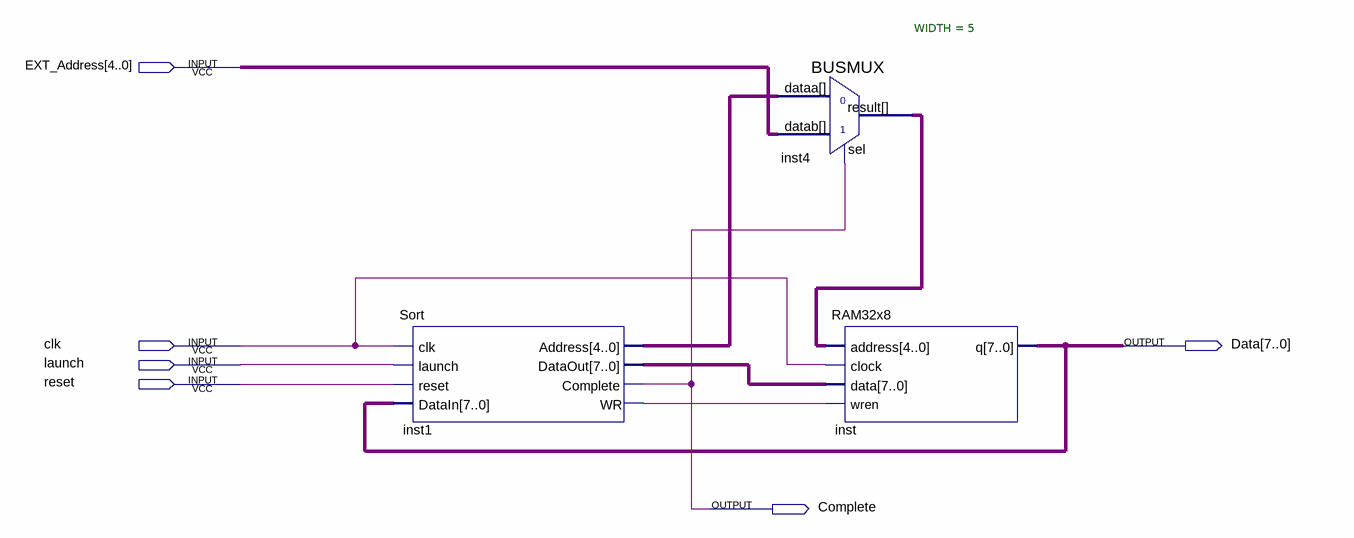
[diagram p0: schematic sheet]
// Quartus schematic Sorter_v2.bdf as structural Verilog: 3 symbols, 6 pins
module Sorter_v2 (
  input  [4:0] EXT_Address,
  input  clk,
  input  launch,
  input  reset,
  output [7:0] Data,
  output Complete
);

  wire inst1_wr;
  wire [4:0] inst1_address, inst4_result;
  wire [7:0] inst1_dataout;

  Sort inst1 (
    .clk(clk), .launch(launch), .reset(reset), .DataIn(Data), .Address(inst1_address),
    .DataOut(inst1_dataout), .Complete(Complete), .WR(inst1_wr));
  BUSMUX #(.WIDTH(5)) inst4 (.datab(EXT_Address), .sel(Complete), .dataa(inst1_address), .result(inst4_result));
  RAM32x8 inst (.address(inst4_result), .clock(clk), .data(inst1_dataout), .wren(inst1_wr), .q(Data));
endmodule
